# EAGLE design ATTINY-V1 (EAGLE 9.3.2)
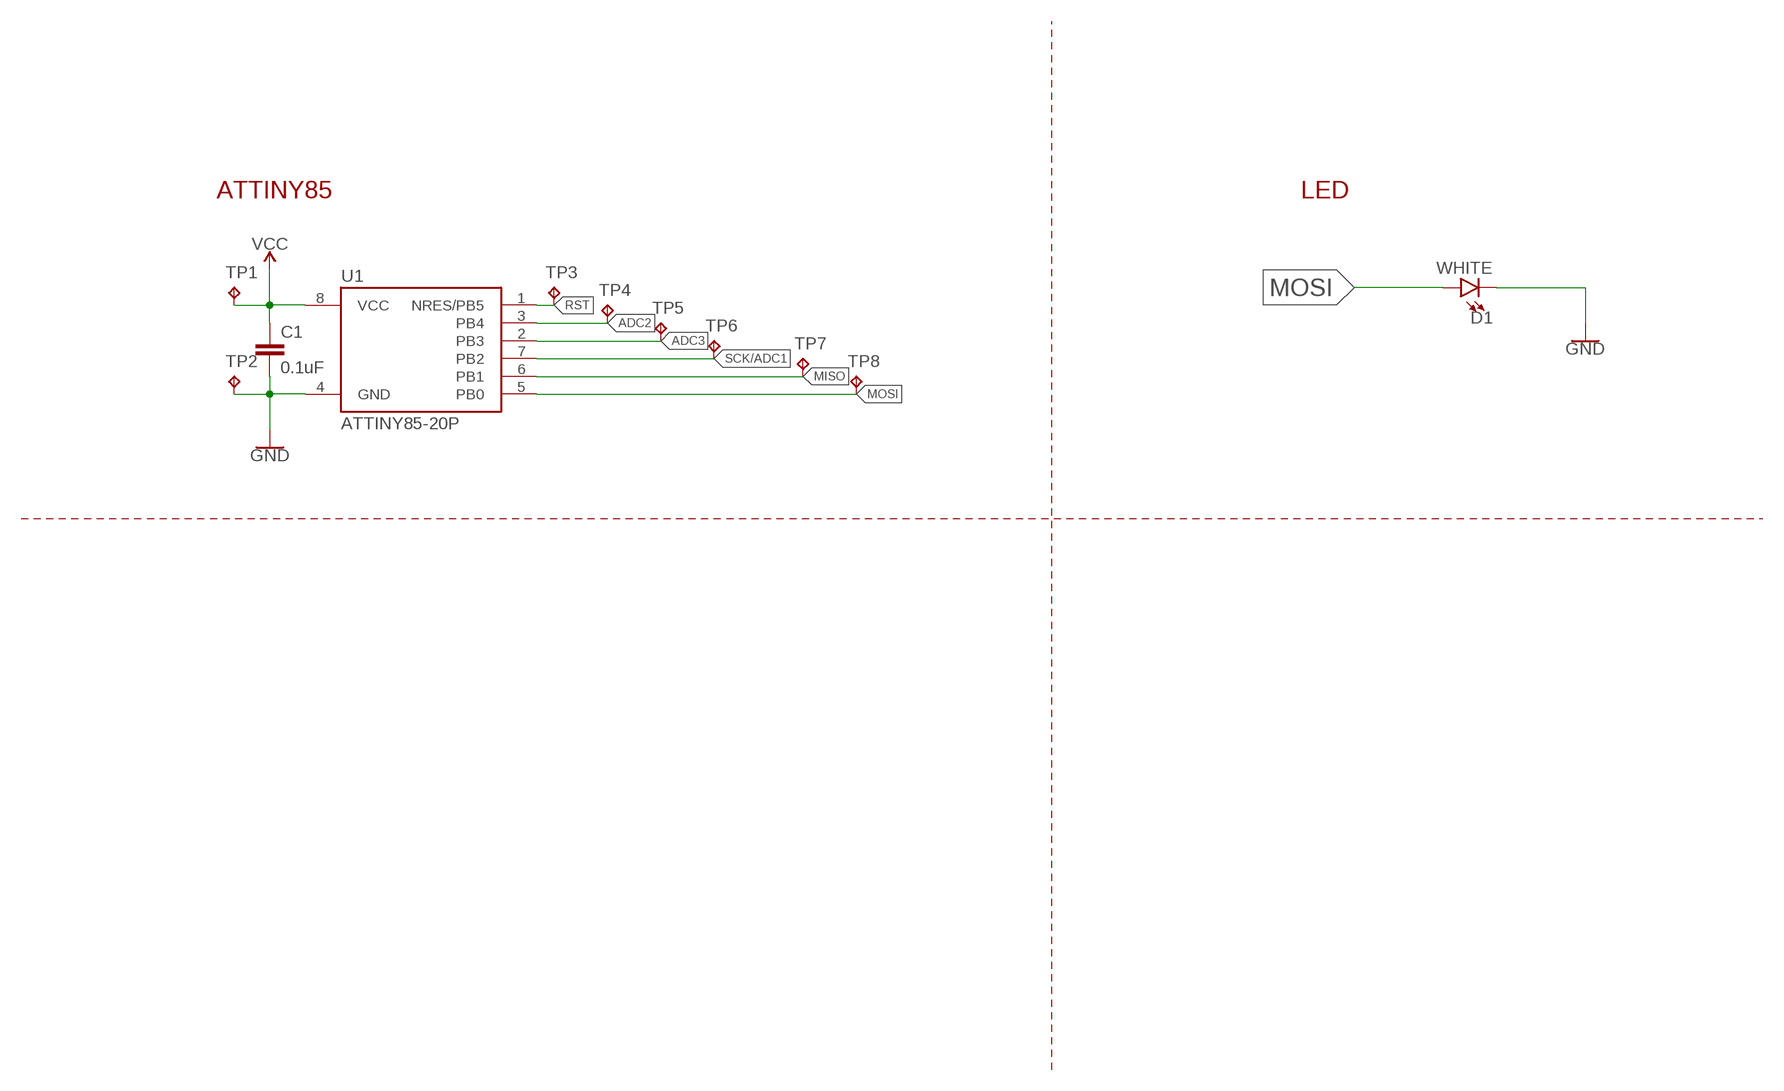
[diagram p0: schematic, sheet 1]

## Parts
C1  0.1uF  0.1UF-KIT-EZ-50V-20%  [CAP-PTH-SMALL-KIT]
D1  WHITE  LED-WHITE1206  [LED-1206]
TP1  TPTP20R  [TP20R]
TP2  TPTP20R  [TP20R]
TP3  TPTP20R  [TP20R]
TP4  TPTP20R  [TP20R]
TP5  TPTP20R  [TP20R]
TP6  TPTP20R  [TP20R]
TP7  TPTP20R  [TP20R]
TP8  TPTP20R  [TP20R]
U1  ATTINY85-20P  [PDIP08_300MIL]

## Nets
ADC2: TP4.TP U1.3(PB4)
ADC3: TP5.TP U1.2(PB3)
GND: C1.2 D1.C TP2.TP U1.4(GND)
MISO: TP7.TP U1.6(PB1)
MOSI: D1.A TP8.TP U1.5(PB0)
RST: TP3.TP U1.1(NRES/PB5)
SCK/ADC1: TP6.TP U1.7(PB2)
VCC: C1.1 TP1.TP U1.8(VCC)

## Notes on the sheet
- ATTINY85 | LED

## Library data of the parts
C1 = SparkFun-Capacitors:0.1UF: 0.1µF ceramic capacitors A capacitor is a passive two-terminal electrical component used to store electrical energy temporarily in an electric field.; PROD_ID: CAP-08370
D1 = SparkFun-LED:LED-WHITE: White SMD LED Used in manufacturing several products at SparkFun. Packages: 0603 - Bright White SMD 0603 package[Product Link] <http://www.kingbrightusa.com/product.asp?catalog_name=LED&product_id=APT1608QWF/D> 1206 - Bright White SMD1206 package [Product Link] <http://www.kingbrightusa.com/product.asp?catalog_name=LED&product_id=APT3216QWF/D> 3014 - Super Bright SMD 3014 package [Datasheet] <http://www.lumileds.com/uploads/459/DS208-pdf> SparkFun Products: Blackberry Trackballer Breakout <https://www.sparkfun.com/products/13169> Digital SandBox <https://www.sparkfun.com/products/12651>; PROD_ID: DIO-09955
TP1-TP8 = testpad:TP: Test pad
U1 = attiny25_45_85:ATTINY85*: ATMEL ATtiny 85 Packages: P = PDIP 08 30mil S = SOIC 08 EIAJ 208mil Technologies Note: for complete ordering code (temp. range, finish, tape&reel etc.) see www.atmel.com • Supply Voltage: V = (1.8…5.5)V | [blank] = (2.7…5.5)V • Speed: 10 = 10 MHz | 20 = 20 MHz Author: Dipl.-Ing. FH Rainer Bayer HHN Hochschule Heilbronn (Heilbronn University), rainer.bayer@hs-heilbronn.de Ingenieurbüro ing-rb, mail@ing-rb.de

## Board
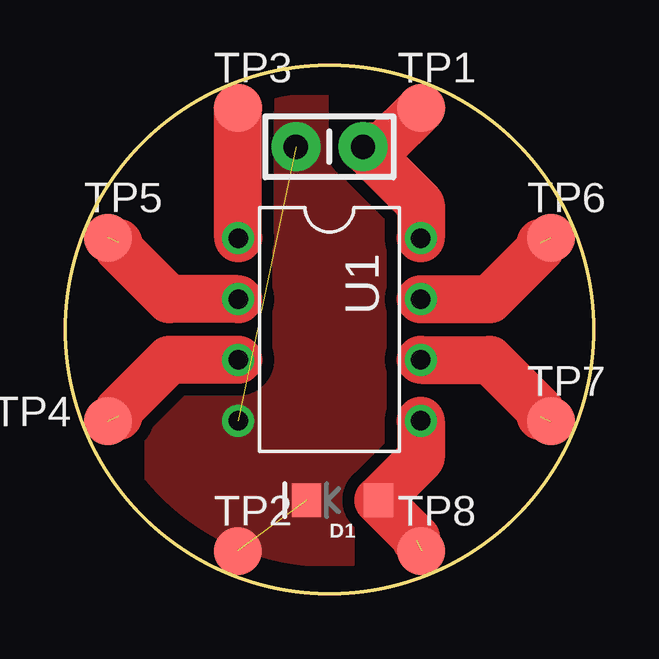
[diagram p1: board, top side]

Size 22 x 22 mm. Coordinates in mm from the lower left corner, seen from the top.
Outline: circle at 11,11 radius 11
Copper layers (1*16): Top 0.035mm / dielectric 1.5mm / Bottom 0.035mm
Design rules "default": minimum track width 6mil, minimum drill 0.35mm, track to track 6mil, track to pad 6mil, pad to pad 6mil, via to via 6mil, smd to smd 6mil, copper to edge 40mil, drill to drill 6mil, minimum pad ring 10mil, minimum via ring 8mil, stop-mask expansion 4mil, vias tented up to drill 0mil, thermal gap 10mil

### Footprints (pad centres in the part's own frame; a part is rotated, then mirrored left to right if it is on the bottom)
CAP-PTH-SMALL-KIT = drill 1.016 pad 2.032: 1 -1.397,0; 2 1.397,0
LED-1206 = smd 1.2 x 1.4: A -1.5,0; C 1.5,0
TP20R = smd 2 x 2: TP 0,0
PDIP08_300MIL = drill 0.813: 1 -3.81,-3.81; 2 -1.27,-3.81; 3 1.27,-3.81; 4 3.81,-3.81; 5 3.81,3.81; 6 1.27,3.81; 7 -1.27,3.81; 8 -3.81,3.81

### Placement (x,y rotation side)
C1  11,18.62 180 top
D1  11.54,3.88 180 top
TP1  14.83,20.24 0 top
TP2  7.17,1.76 0 top
TP3  7.17,20.24 0 top
TP4  1.76,7.17 0 top
TP5  1.76,14.83 0 top
TP6  20.24,14.83 0 top
TP7  20.24,7.17 0 top
TP8  14.83,1.76 0 top
U1  11,11 270 top

### Tracks (layer width: path | path; a pad name or v marks a point on that pad's centre or on a via)
ADC2  (1 unrouted)
  Top 2: U1.3 4.32,9.73 2.21,7.62 2.21,7.38
ADC3  (1 unrouted)
  Top 2: U1.2 4.32,12.27 2.21,14.38 2.21,14.62
GND  (2 unrouted)
  pour Top (isolate 0.5, no thermals): -4,28 26,28 26,-7 -4,-7
MISO  (1 unrouted)
  Top 2: U1.6 17.68,9.73 19.8,7.62 19.8,7.38
MOSI  (1 unrouted)
  Top 2: U1.5 14.81,5.65 D1.A 14.62,2.3 14.62,2.21
RST
  Top 2: U1.1 7.19,20.24 TP3.TP
SCK/ADC1  (1 unrouted)
  Top 2: U1.7 17.68,12.27 19.8,14.38 19.8,14.62
VCC
  Top 2: TP1.TP 13.21,18.62 C1.1 14.81,16.21 U1.8